# EAGLE design JediLightSwitch (EAGLE 7.4.0)

## Sheet 1 of 2
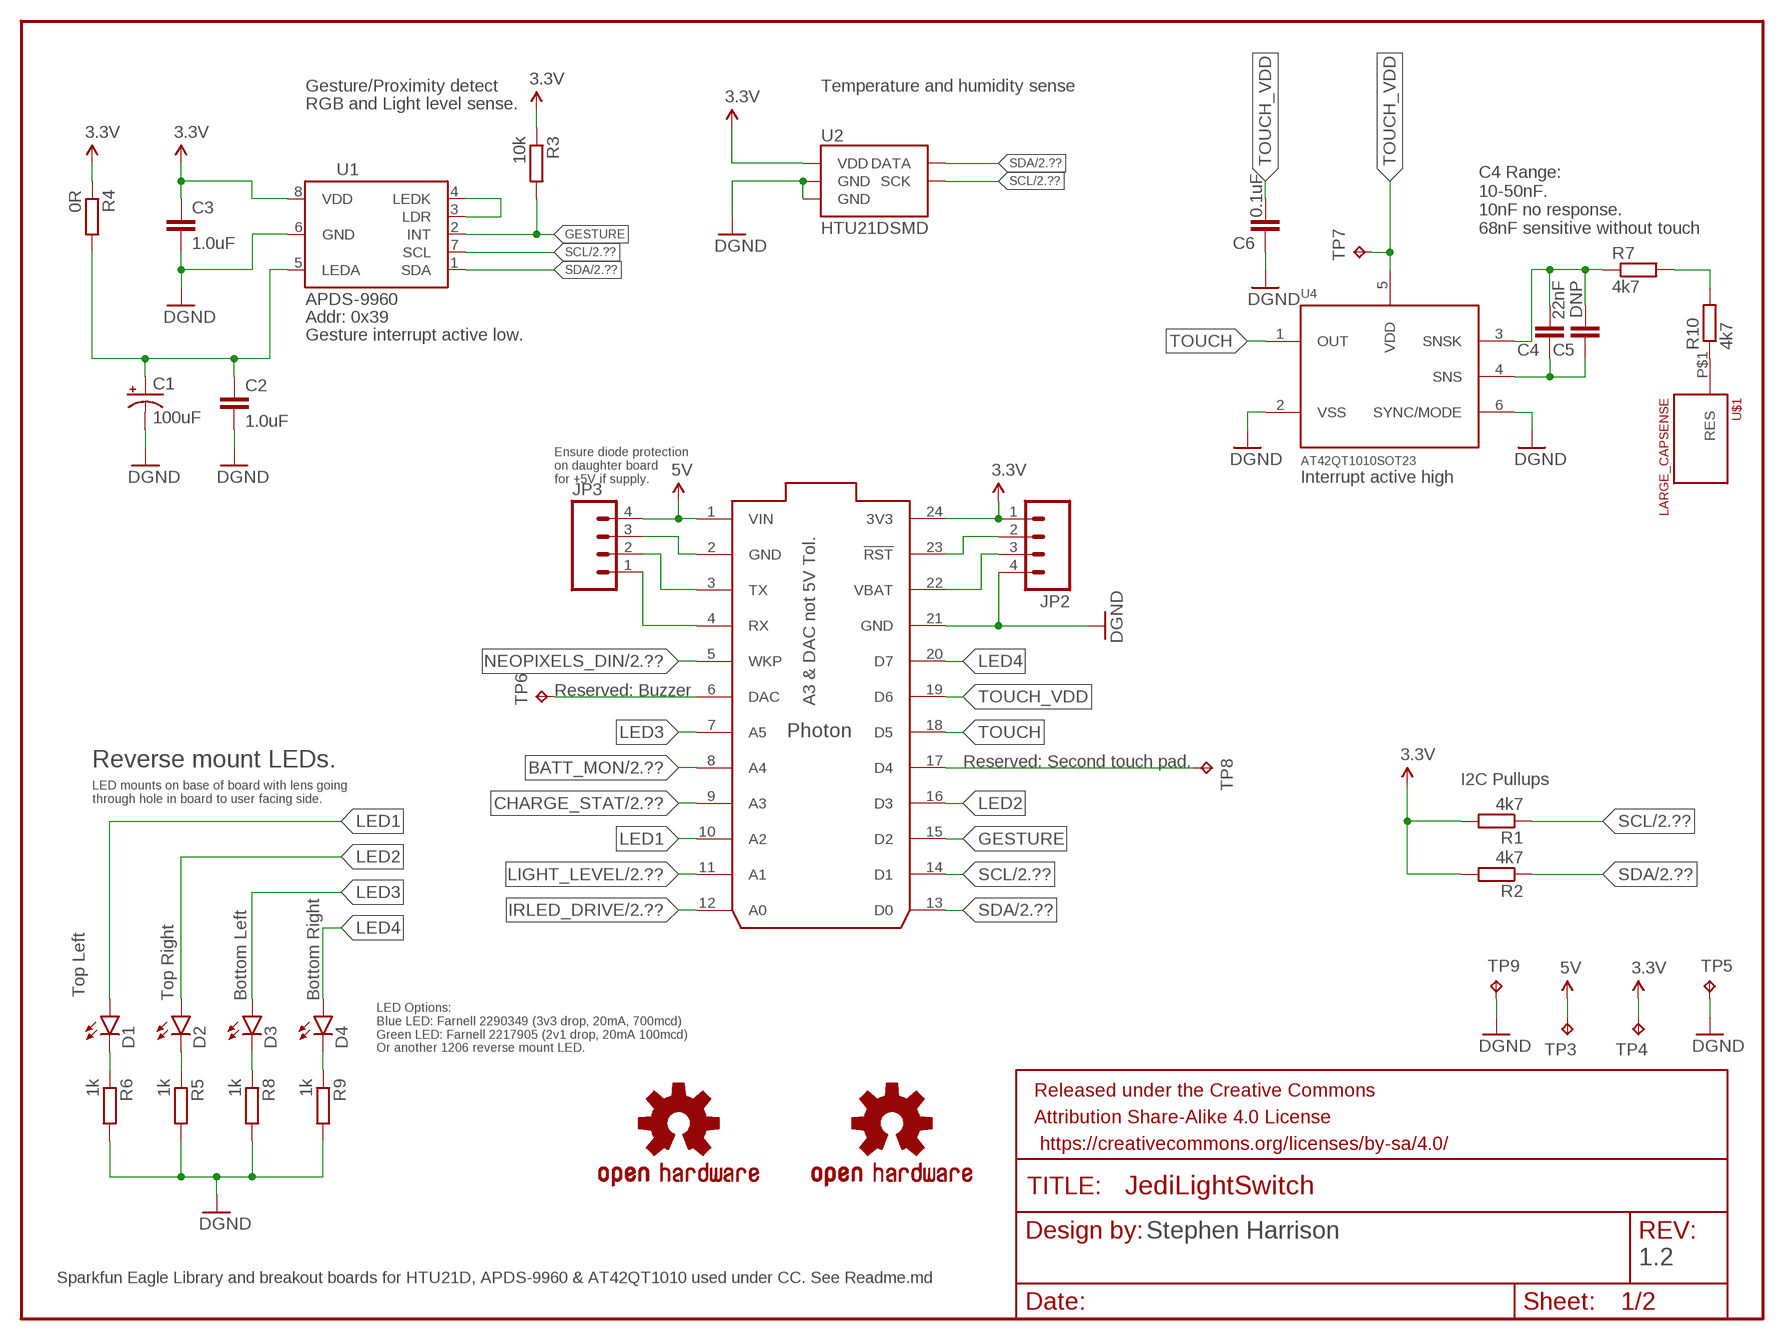
[diagram p0: schematic, sheet 1]

### Parts
C1  100uF  100UF-10V-10%(TANT)  [EIA7343]
C2  1.0uF  C-EUC0805  [C0805]
C3  1.0uF  C-EUC0805  [C0805]
C4  22nF  C-EUC0805  [C0805]
C5  DNP  C-EUC0805  [C0805]
C6  0.1uF  C-EUC0805  [C0805]
D1  LED1206-BOTTOM  [LED-1206-BOTTOM]
D2  LED1206-BOTTOM  [LED-1206-BOTTOM]
D3  LED1206-BOTTOM  [LED-1206-BOTTOM]
D4  LED1206-BOTTOM  [LED-1206-BOTTOM]
FRAME2  FRAME-LETTER  [CREATIVE_COMMONS]
JP2  M04SMD_STRAIGHT_COMBO  [1X04_SMD_STRAIGHT_COMBO]
JP3  M04SMD_STRAIGHT_COMBO  [1X04_SMD_STRAIGHT_COMBO]
LOGO1  OSHW-LOGOM  [OSHW-LOGO-M]
LOGO2  OSHW-LOGOM  [OSHW-LOGO-M]
R1  4k7  R-EU_R0805  [R0805]
R2  4k7  R-EU_R0805  [R0805]
R3  10k  R-EU_R0805  [R0805]
R4  0R  R-EU_R0805  [R0805]
R5  1k  R-EU_R0805  [R0805]
R6  1k  R-EU_R0805  [R0805]
R7  4k7  R-EU_R0805  [R0805]
R8  1k  R-EU_R0805  [R0805]
R9  1k  R-EU_R0805  [R0805]
R10  4k7  R-EU_R0805  [R0805]
TP3  TPTP20R  [TP20R]
TP4  3v3  TPTP20R  [TP20R]
TP5  TPTP20R  [TP20R]
TP6  TPTP20R  [TP20R]
TP7  TPTP20R  [TP20R]
TP8  TPTP20R  [TP20R]
TP9  TPTP20R  [TP20R]
U1  APDS-9960  [APDS-9960]
U2  HTU21DSMD  [HTU21D]
U3  PHOTON_SMD  [PHOTON_SMD]
U4  AT42QT1010SOT23  [SOT23-6]
U$1  LARGE_CAPSENSE  [LARGE_CAPSENSE]

### Nets
3.3V: C3.1 JP2.1 R1.2 R2.2 R3.1 R4.1 TP4.TP U1.8(VDD) U2.VDD U3.24(3V3) ; also sheet 2
5V: JP3.4 TP3.TP U3.1(VIN) ; also sheet 2
BATT_MON: U3.8(A4) ; also sheet 2
CHARGE_STAT: U3.9(A3) ; also sheet 2
D4: TP8.TP U3.17(D4)
DAC: TP6.TP U3.6(DAC)
GESTURE: R3.2 U1.2(INT) U3.15(D2)
GND: C1.C(-) C2.2 C3.2 C6.1 JP2.4 JP3.3 R5.2 R6.2 R8.2 R9.2 TP5.TP TP9.TP U1.6(GND) U2.7(GND) U2.GND U3.2(GND) U3.21(GND) U4.2(VSS) U4.6(SYNC/MODE) ; supply symbol labelled DGND ; also sheet 2
IRLED_DRIVE: U3.12(A0) ; also sheet 2
LED1: D1.A U3.10(A2)
LED2: D2.A U3.16(D3)
LED3: D3.A U3.7(A5)
LED4: D4.A U3.20(D7)
LIGHT_LEVEL: U3.11(A1) ; also sheet 2
N$1: U1.3(LDR) U1.4(LEDK)
N$2: C1.A(+) C2.1 R4.2 U1.5(LEDA)
N$3: D2.C R5.1
N$4: D1.C R6.1
N$5: JP2.2 U3.23(!RST)
N$7: JP2.3 U3.22(VBAT)
N$8: R7.2 R10.2
N$9: R10.1 U$1.P$1(RES)
N$14: JP3.1 U3.4(RX)
N$15: JP3.2 U3.3(TX)
N$19: C4.2 C5.2 R7.1 U4.3(SNSK)
N$20: C4.1 C5.1 U4.4(SNS)
N$30: D3.C R8.1
N$31: D4.C R9.1
NEOPIXELS_DIN: U3.5(WKP) ; also sheet 2
SCL: R1.1 U1.7(SCL) U2.SCK U3.14(D1) ; also sheet 2
SDA: R2.1 U1.1(SDA) U2.DATA U3.13(D0) ; also sheet 2
TOUCH: U3.18(D5) U4.1(OUT)
TOUCH_VDD: C6.2 TP7.TP U3.19(D6) U4.5(VDD)
Unconnected: U3.25(EN) U3.26(!SETUP) U3.27(RGB_RED) U3.28(RGB_GREEN) U3.29(RGB_BLUE) U3.30(USB_D-) U3.31(USB_D+)

### Notes on the sheet
- Gesture/Proximity detect | Temperature and humidity sense
- RGB and Light level sense.
- C4 Range: 
  10-50nF. 
  10nF no response.
  68nF sensitive without touch
- Addr: 0x39
- Gesture interrupt active low.
- Ensure diode protection 
  on daughter board 
  for +5V if supply.
- Interrupt active high
- A3 & DAC not 5V Tol.
- Reserved: Buzzer
- Reverse mount LEDs. | Reserved: Second touch pad.
- I2C Pullups
- LED mounts on base of board with lens going 
  through hole in board to user facing side.
- Top Left | Top Right | Bottom Left | Bottom Right
- LED Options:
  Blue LED: Farnell 2290349 (3v3 drop, 20mA, 700mcd)
  Green LED: Farnell 2217905 (2v1 drop, 20mA 100mcd)
  Or another 1206 reverse mount LED.
- Stephen Harrison
- 1.2
- Sparkfun Eagle Library and breakout boards for HTU21D, APDS-9960 & AT42QT1010 used under CC. See Readme.md

## Sheet 2 of 2
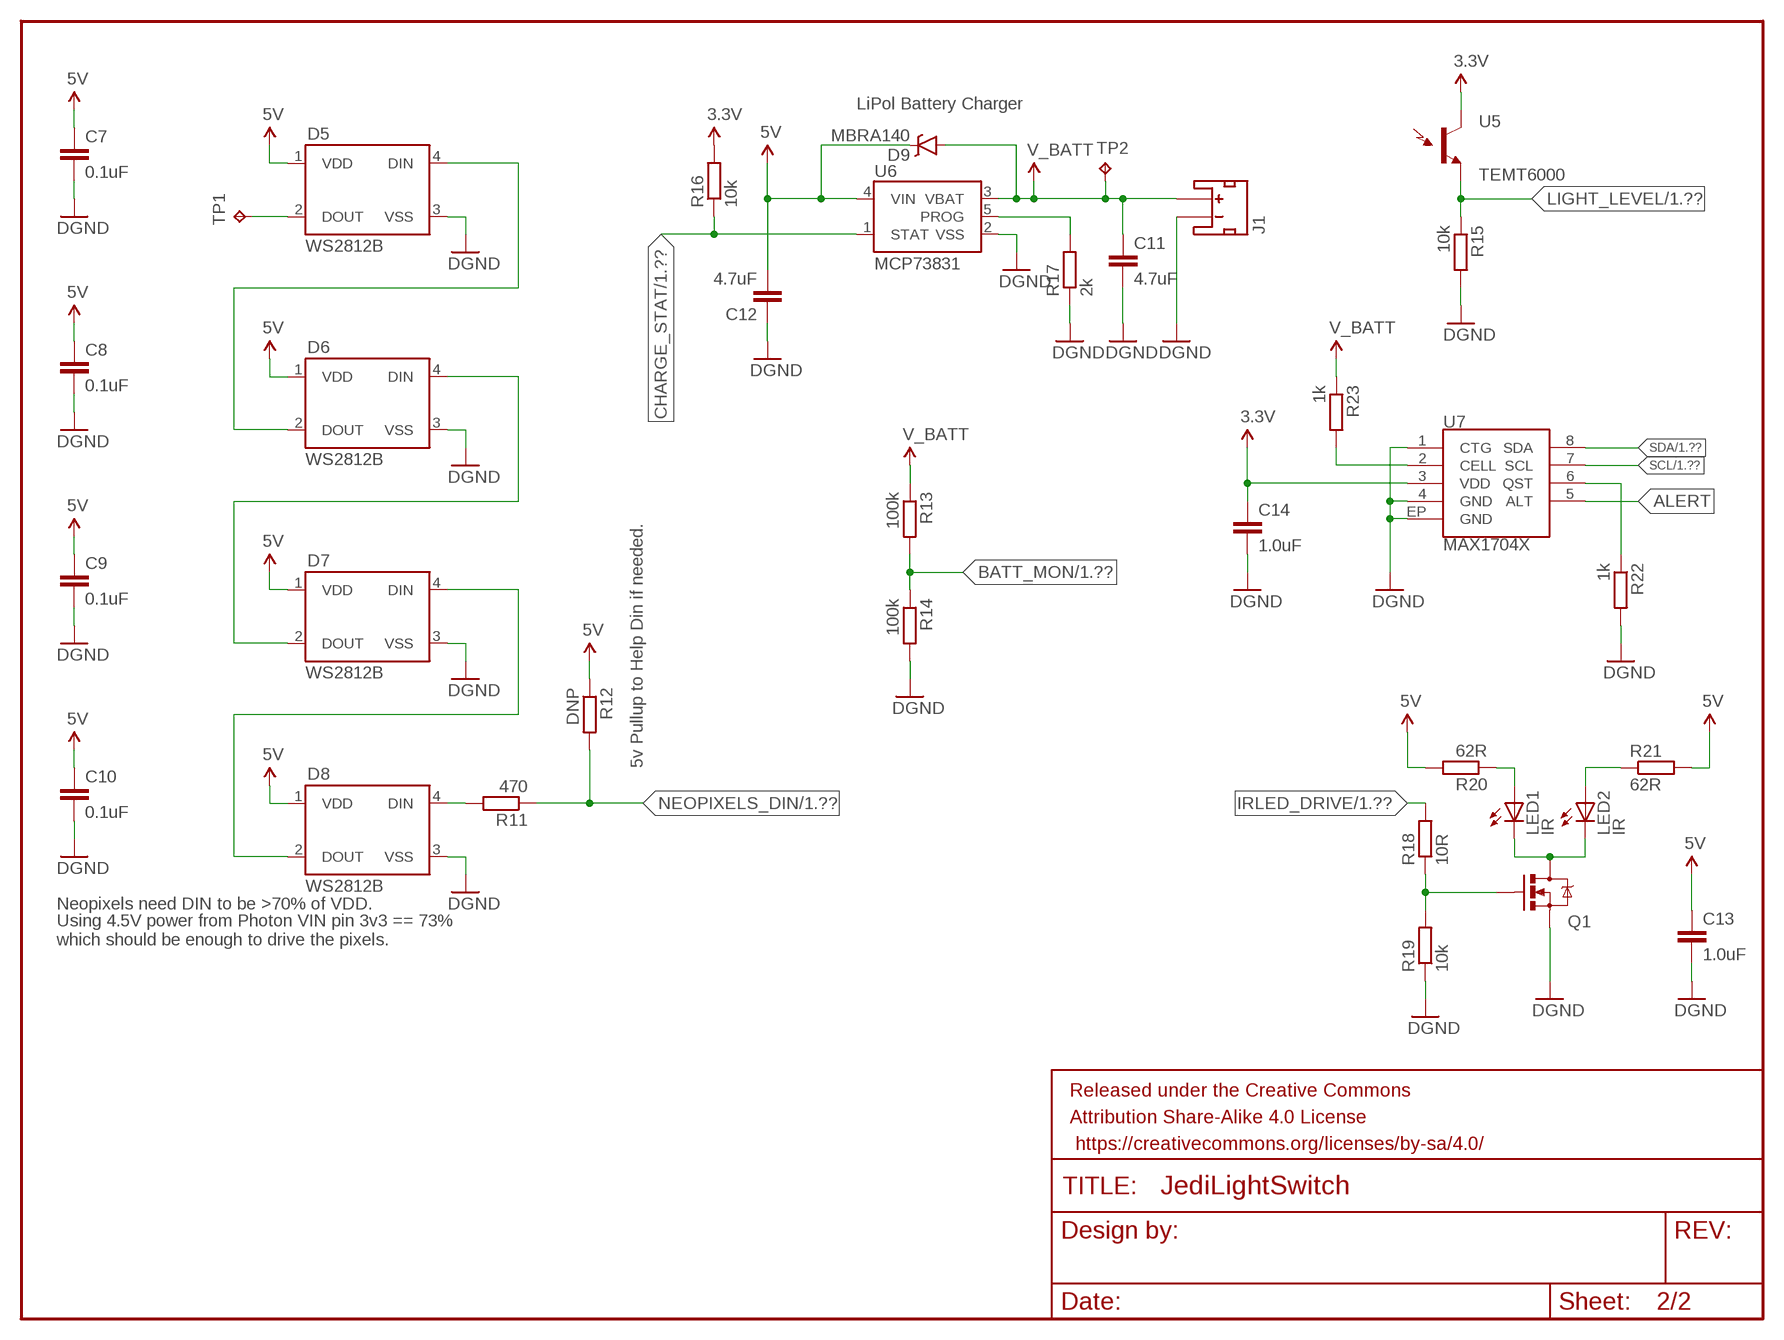
[diagram p1: schematic, sheet 2]

### Parts
C7  0.1uF  C-EUC0805  [C0805]
C8  0.1uF  C-EUC0805  [C0805]
C9  0.1uF  C-EUC0805  [C0805]
C10  0.1uF  C-EUC0805  [C0805]
C11  4.7uF  C-EUC0805  [C0805]
C12  4.7uF  C-EUC0805  [C0805]
C13  1.0uF  C-EUC0805  [C0805]
C14  1.0uF  C-EUC0805  [C0805]
D5  WS2812B  [WS2812B]
D6  WS2812B  [WS2812B]
D7  WS2812B  [WS2812B]
D8  WS2812B  [WS2812B]
D9  MBRA140  [SMA-DIODE]
FRAME1  FRAME-LETTERNO_PACKAGE  [DUMMY]
J1  JST_2MM_MALE  [JST-2-SMD]
LED1  IR  LEDSMT1206  [1206]
LED2  IR  LEDSMT1206  [1206]
Q1  MOSFET-NCHANNELAO3404A  [SOT23-3]
R11  470  R-EU_R0805  [R0805]
R12  DNP  R-EU_R0805  [R0805]
R13  100k  R-EU_R0805  [R0805]
R14  100k  R-EU_R0805  [R0805]
R15  10k  R-EU_R0805  [R0805]
R16  10k  R-EU_R0805  [R0805]
R17  2k  R-EU_R0805  [R0805]
R18  10R  R-EU_R0805  [R0805]
R19  10k  R-EU_R0805  [R0805]
R20  62R  R-EU_R0805  [R0805]
R21  62R  R-EU_R0805  [R0805]
R22  1k  R-EU_R0805  [R0805]
R23  1k  R-EU_R0805  [R0805]
TP1  TPTP20R  [TP20R]
TP2  TPTP20R  [TP20R]
U5  TEMT6000  LIGHTSENSORTEMT6000  [TEMT6000-SEN]
U6  MCP73831  [SOT23-5]
U7  MAX1704X  [TDFN-8]

### Nets
3.3V: C14.1 R16.2 U5.COLLECTOR(C1) U7.3(VDD) ; also sheet 1
5V: C7.1 C8.1 C9.1 C10.1 C12.2 C13.1 D5.1(VDD) D6.1(VDD) D7.1(VDD) D8.1(VDD) D9.C R12.1 R20.2 R21.2 U6.4(VIN) ; also sheet 1
ALERT: U7.5(ALT)
BATT_MON: R13.2 R14.1 ; also sheet 1
CHARGE_STAT: R16.1 U6.1(STAT) ; also sheet 1
GND: C7.2 C8.2 C9.2 C10.2 C11.2 C12.1 C13.2 C14.2 D5.3(VSS) D6.3(VSS) D7.3(VSS) D8.3(VSS) J1.1(-) Q1.2(S) R14.2 R15.2 R17.1 R19.1 R22.2 U6.2(VSS) U7.1(CTG) U7.4(GND) U7.EP(GND) ; supply symbol labelled DGND ; also sheet 1
IRLED_DRIVE: R18.2 ; also sheet 1
LIGHT_LEVEL: R15.1 U5.EMITTER(E1) ; also sheet 1
N$6: Q1.1(G) R18.1 R19.2
N$11: R17.2 U6.5(PROG)
N$12: LED1.A R20.1
N$13: D7.4(DIN) D8.2(DOUT)
N$16: R23.2 U7.2(CELL)
N$17: D5.2(DOUT) TP1.TP
N$18: D6.4(DIN) D7.2(DOUT)
N$21: D5.4(DIN) D6.2(DOUT)
N$22: D8.4(DIN) R11.2
N$23: LED2.A R21.1
N$24: LED1.C LED2.C Q1.3(D)
N$25: R22.1 U7.6(QST)
NEOPIXELS_DIN: R11.1 R12.2 ; also sheet 1
SCL: U7.7(SCL) ; also sheet 1
SDA: U7.8(SDA) ; also sheet 1
V_BATT: C11.1 D9.A J1.2(+) R13.1 R23.1 TP2.TP U6.3(VBAT)
Unconnected: J1.NC1(PAD1) J1.NC2(PAD2)

### Notes on the sheet
- LiPol Battery Charger
- 5v Pullup to Help Din if needed.
- Neopixels need DIN to be >70% of VDD.
- Using 4.5V power from Photon VIN pin 3v3 == 73% 
  which should be enough to drive the pixels.

## Library data of the parts
C1 = SparkFun-Capacitors:100UF-10V-10%(TANT): CAP-07890; PROD_ID: CAP-07890
C2-C14 = rcl:C-EU: CAPACITOR, European symbol
D1-D4 = SparkFun-LED:LED: LEDs Standard schematic elements and footprints for 5mm, 3mm, 1206, and 0603 sized LEDs. 5mm - Spark Fun Electronics SKU : COM-00529 (and others)
D5-D8 = SparkFun-LED:WS2812B: WS2812B - Intelligent control LED integrated light source Technical Specifications: Power Supply Voltage (VDD): 3.5 to 5.3 V Input Voltage (VI): -0.5 to VDD+0.5 V Operating Junction Temperature (Topt): -25°C to +80°C Storage Temperature Range (Tstg): -55°C to +150°C; PROD_ID: DIO-12503
D9 = SparkFun-DiscreteSemi:MBRA140: 40V, 1A Schottky rectifier SMA/DO-214AC package DIO-08053; PROD_ID: DIO-08053
FRAME1 = SparkFun-Aesthetics:FRAME-LETTER: Schematic Frame Standard 8.5x11 US Letter frame; DESIGNER: Nobody; VERSION: v01
FRAME2 = SparkFun-Aesthetics:FRAME-LETTER: Schematic Frame Standard 8.5x11 US Letter frame
J1 = SparkFun-Connectors:JST_2MM_MALE: Mates to single-cell LiPo batteries. CONN-11443 Now with smashable polarity marks!; BTM_NEG: -; BTM_POS: +; PROD_ID: CONN-11443; TOP_NEG: -; TOP_POS: +
JP2 JP3 = SparkFun-Connectors:M04: Header 4 Standard 4-pin 0.1" header. Use with straight break away headers (SKU : PRT-00116), right angle break away headers (PRT-00553), swiss pins (PRT-00743), machine pins (PRT-00117), and female headers (PRT-00115). Molex polarized connector foot print use with SKU : PRT-08231 with associated crimp pins and housings. 1MM SMD Version SKU: PRT-10208; PROD_ID: CONN-08511; VALUE: 1X04_SMD_STRAIGHT_COMBO
LED1 LED2 = led:LED: LED OSRAM: - CHIPLED LG R971, LG N971, LY N971, LG Q971, LY Q971, LO R971, LY R971 LH N974, LH R974 LS Q976, LO Q976, LY Q976 LO Q996 - Hyper CHIPLED LW Q18S LB Q993, LB Q99A, LB R99A - SideLED LS A670, LO A670, LY A670, LG A670, LP A670 LB A673, LV A673, LT A673, LW A673 LH A674 LY A675 LS A676, LA A676, LO A676, LY A676, LW A676 LS A679, LY A679, LG A679 - Hyper Micro SIDELED® LS Y876, LA Y876, LO Y876, LY Y876 LT Y87S - SmartLED LW L88C, LW L88S LB L89C, LB L89S, LG L890 LS L89K, LO L89K, LY L89K LS L896, LA L896, LO L896, LY L896 - TOPLED LS T670, LO T670, LY T670, LG T670, LP T670 LSG T670, LSP T670, LSY T670, LOP T670, LYG T670 LG T671, LOG T671, LSG T671 LB T673, LV T673, LT T673, LW T673 LH T674 LS T676, LA T676, LO T676, LY T676, LB T676, LH T676, LSB T676, LW T676 LB T67C, LV T67C, LT T67C, LS T67K, LO T67K, LY T67K, LW E67C LS E67B, LA E67B, LO E67B, LY E67B, LB E67C, LV E67C, LT E67C LW T67C LS T679, LY T679, LG T679 LS T770, LO T770, LY T770, LG T770, LP T770 LB T773, LV T773, LT T773, LW T773 LH T774 LS E675, LA E675, LY E675, LS T675 LS T776, LA T776, LO T776, LY T776, LB T776 LHGB T686 LT T68C, LB T68C - Hyper Mini TOPLED® LB M676 - Mini TOPLED Santana® LG M470 LS M47K, LO M47K, LY M47K Source: http://www.osram.convergy.de LUXEON: - LUMILED® LXK2-PW12-R00, LXK2-PW12-S00, LXK2-PW14-U00, LXK2-PW14-V00 LXK2-PM12-R00, LXK2-PM12-S00, LXK2-PM14-U00 LXK2-PE12-Q00, LXK2-PE12-R00, LXK2-PE12-S00, LXK2-PE14-T00, LXK2-PE14-U00 LXK2-PB12-K00, LXK2-PB12-L00, LXK2-PB12-M00, LXK2-PB14-N00, LXK2-PB14-P00, LXK2-PB14-Q00 LXK2-PR12-L00, LXK2-PR12-M00, LXK2-PR14-Q00, LXK2-PR14-R00 LXK2-PD12-Q00, LXK2-PD12-R00, LXK2-PD12-S00 LXK2-PH12-R00, LXK2-PH12-S00 LXK2-PL12-P00, LXK2-PL12-Q00, LXK2-PL12-R00 Source: www.luxeon.com KINGBRIGHT: KA-3528ASYC Source: www.kingbright.com
LOGO1 LOGO2 = SparkFun-Aesthetics:OSHW-LOGO: Open Source Hardware Logo This logo indicates the piece of hardware it is found on incorporates a OSHW license and/or adheres to the definition of open source hardware found here: http://freedomdefined.org/OSHW
Q1 = SparkFun-DiscreteSemi:MOSFET-NCHANNEL: Common NMOSFET Parts MFG P/N Store ID Prod ID FDD8780 TRANS-09984 SI7820DN TRANS-11055 FDS6630A IC-08089 2N7002PW TRANS-11151 FQP30N06L COM-10213 TRANS-10060 BSS123LT1G TRANS-08345 BSS138 TRANS-00830 BS170 2N7000; PROD_ID: TRAN-12988
R1-R23 = rcl:R-EU_: RESISTOR, European symbol
TP1-TP9 = testpad:TP: Test pad
U1 = SparkFun-Sensors:APDS-9960: Avago APDS-9960 digital proximity, ambient light, RGB, and gesture sensor.; PROD_ID: SEN-12005
U2 = SparkFun-Sensors:HTU21D; PROD_ID: IC-11793
U3 = Particle:PHOTON_SMD: Photon (without headers) - designed to be surface mounted with 7 extra exposed pads on the bottom of the board which include, 3 RGB LED outputs, /SETUP, EN (3.3V SMPS enable input), USB D+ and USB D-.
U4 = SparkFun-DigitalIC:AT42QT1010
U5 = SparkFun-Sensors:LIGHTSENSOR: Ambient Light Sensor Simple light detection sensor. Output varies with light intensity input. Spark Fun Electronics SKU : COM-08348
U6 = SparkFun-PowerIC:MCP73831: Miniature single cell, fully integrated Li-Ion, Li-polymer charge management controller http://ww1.microchip.com/downloads/en/DeviceDoc/20001984g.pdf IC-09995; PROD_ID: IC-09995
U7 = SparkFun-PowerIC:MAX1704X: MAX17043/MAX17044: Battery Fuel Guage (43 is 1cell, 44 is 2cell); PROD-ID: IC-10399
U$1 = Tinamous:LARGE_CAPSENSE

## Board
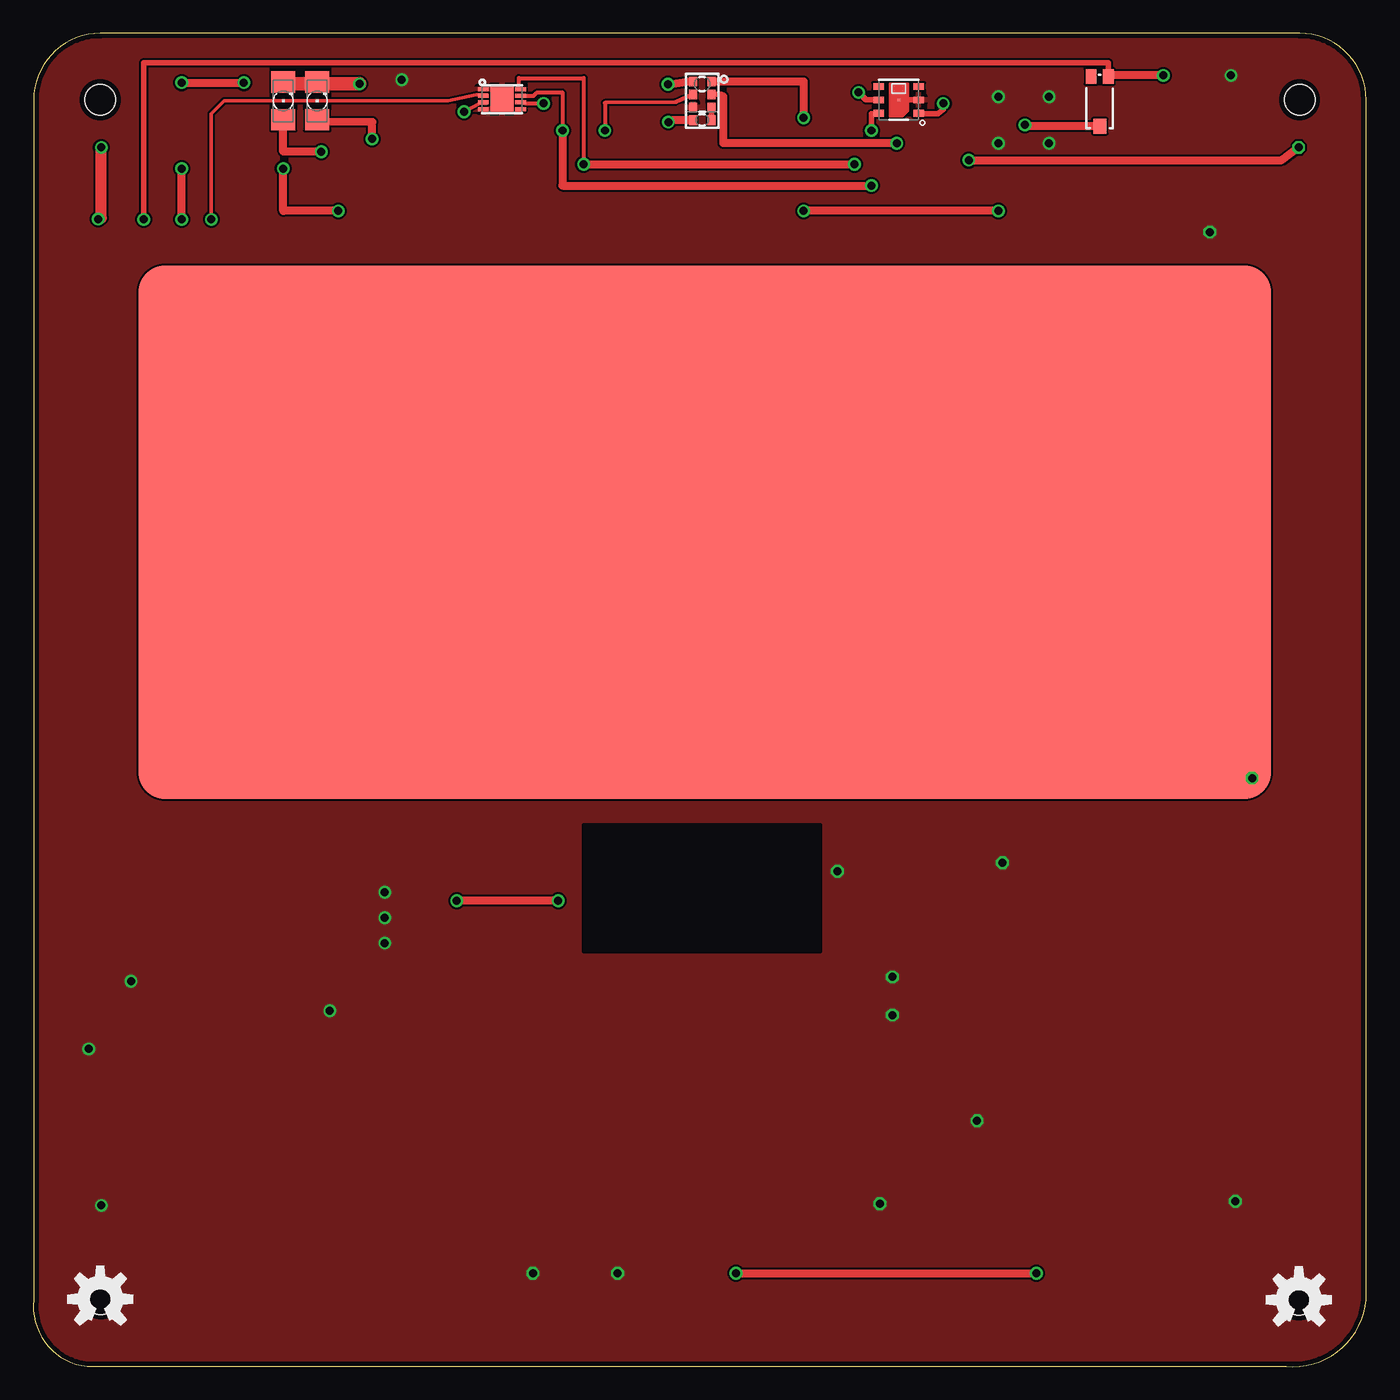
[diagram p2: board, top side]
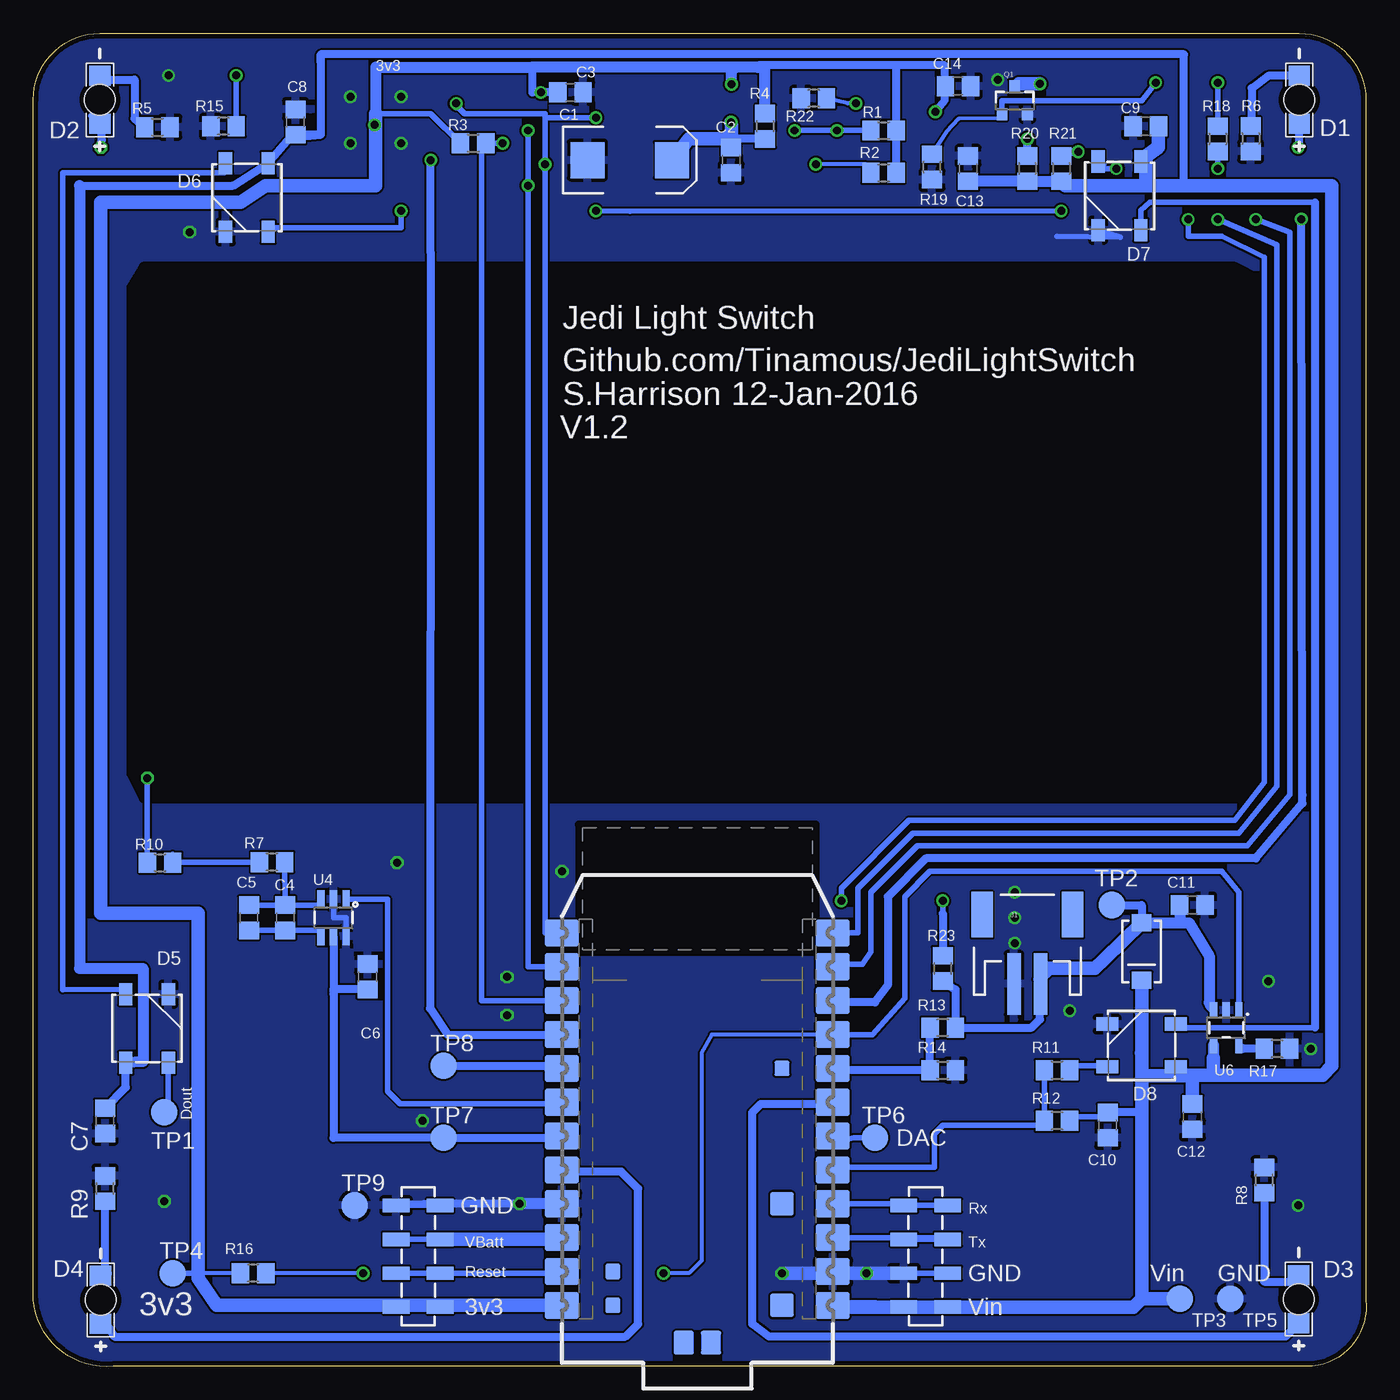
[diagram p3: board, bottom side, seen from below]

Size 100.03 x 100.02 mm. Coordinates in mm from the lower left corner, seen from the top.
Outline: 4.03,0.02 94.03,0.02 arc90 100.03,5.02 100.03,95.02 arc90 95.03,100.02 5.03,100.02 arc90 0.03,95.02 0.03,5.02 arc90 4.03,0.02
Copper layers (1*16): Top 0.0356mm / dielectric 1.5011mm / Bottom 0.0356mm
Design rules "OSHPark *": minimum track width 6mil, minimum drill 13mil, track to track 6mil, track to pad 6mil, pad to pad 6mil, via to via 6mil, smd to smd 6mil, copper to edge 15mil, drill to drill 6mil, minimum pad ring 7mil, minimum via ring 7mil, stop-mask expansion 3mil, vias tented up to drill 25mil, thermal gap 10mil
tRestrict: area 41.3,31.1 to 59.1,40.7
bRestrict: area 41.3,31.1 to 59.1,40.7; area 8,42.6 to 92.7,82.6

### Footprints (pad centres in the part's own frame; a part is rotated, then mirrored left to right if it is on the bottom)
EIA7343 = smd 2.55 x 2.7: A 3.17,0; C -3.17,0
C0805 = smd 1.3 x 1.5: 1 -0.95,0; 2 0.95,0
LED-1206-BOTTOM = smd 1.5 x 1.6: A -1.8,0; C 1.8,0 | hole 2.3: 0,0
WS2812B = smd 1.651 x 1: 1 -2.577,1.6; 2 -2.577,-1.6; 3 2.577,-1.6; 4 2.577,1.6
SMA-DIODE = smd 1.27 x 1.47: A -2.15,0; C 2.15,0
JST-2-SMD = smd 1 x 4.6: 1 -1,-3.7; 2 1,-3.7 | smd 1.6 x 3.4: NC1 -3.4,1.5; NC2 3.4,1.5
1X04_SMD_STRAIGHT_COMBO = smd 1 x 2: 1 0,-1.65; 1-2 0,1.65; 2 2.54,1.65; 2-2 2.54,-1.65; 3 5.08,-1.65; 3-2 5.08,1.65; 4 7.62,1.65; 4-2 7.62,-1.65
1206 = smd 1.6 x 1.803: A -1.422,0; C 1.422,0
SOT23-3 = smd 0.8 x 0.9: 1 -0.95,-1; 2 0.95,-1; 3 0,1.1
R0805 = smd 1.3 x 1.5: 1 -0.95,0; 2 0.95,0
TP20R = smd 2 x 2: TP 0,0
APDS-9960 = smd 0.6 x 0.72: 1 0.7,1.455; 2 0.7,0.485; 3 0.7,-0.485; 4 0.7,-1.455; 5 -0.7,-1.455; 6 -0.7,-0.485; 7 -0.7,0.485; 8 -0.7,1.455
HTU21D = smd 0.2 x 0.2: 7 0,0 | smd 0.8 x 0.5: DATA 1.5,-1; GND 1.5,0; NC@1 -1.5,1; NC@6 1.5,1; SCK -1.5,-1; VDD -1.5,0
PHOTON_SMD = smd 2.54 x 2.032: 1 0,32.258; 2 0,29.718; 3 0,27.178; 4 0,24.638; 5 0,22.098; 6 0,19.558; 7 0,17.018; 8 0,14.478; 9 0,11.938; 10 0,9.398; 11 0,6.858; 12 0,4.318; 13 20.32,4.318; 14 20.32,6.858; 15 20.32,9.398; 16 20.32,11.938; 17 20.32,14.478; 18 20.32,17.018; 19 20.32,19.558; 20 20.32,22.098; 21 20.32,24.638; 22 20.32,27.178; 23 20.32,29.718; 24 20.32,32.258 | smd 1.778 x 1.778: 25 3.81,32.258; 26 3.81,24.638 | smd 1.143 x 1.143: 27 3.81,14.478; 28 16.51,29.718; 29 16.51,32.258 | smd 1.524 x 1.778: 30 11.176,35.052; 31 9.144,35.052
SOT23-6 = smd 0.55 x 1.35: 1 -0.95,-1.375; 2 0,-1.375; 3 0.95,-1.375; 4 0.95,1.375; 5 0,1.375; 6 -0.95,1.375
TEMT6000-SEN = smd 1.1 x 0.8: BASE -1.87,-0.65; EMITTER -1.87,0.65 | smd 1.1 x 1: COLLECTOR 1.86,0.01
SOT23-5 = smd 0.55 x 1.2: 1 -0.95,-1.3; 2 0,-1.3; 3 0.95,-1.3; 4 0.95,1.3; 5 -0.95,1.3
TDFN-8 = smd 0.8 x 0.3: 1 -1.4,0.75; 2 -1.4,0.25; 3 -1.4,-0.25; 4 -1.4,-0.75; 5 1.4,-0.75; 6 1.4,-0.25; 7 1.4,0.25; 8 1.4,0.75 | smd 1.73 x 1.88: EP 0,0
LARGE_CAPSENSE = smd 85 x 40: P$1 12.865,17.495

### Placement (x,y rotation side)
C1  55.27,90.51 0 bottom
C2  47.65,90.51 270 bottom
C3  59.72,95.59 0 bottom
C4  81.12,33.68 90 bottom
C5  83.85,33.68 90 bottom
C6  74.94,29.25 270 bottom
C7  94.64,18.44 270 bottom
C8  80.35,93.37 90 bottom
C9  16.54,93.05 180 bottom
C10  19.39,18.12 270 bottom
C11  13.04,34.63 0 bottom
C12  13.04,18.76 90 bottom
C13  29.87,89.88 90 bottom
C14  30.63,96.06 0 bottom
D1  5.03,95.03 90 bottom
D2  95.03,95.03 90 bottom
D3  5.07,5.07 90 bottom
D4  94.98,5 90 bottom
D5  91.49,25.37 90 bottom
D6  84,87.7 270 bottom
D7  18.52,87.83 270 bottom
D8  16.86,24.1 180 bottom
D9  16.85,31.14 270 bottom
FRAME1  -27.91,-35.85 0 top  (outside the outline)
FRAME2  19.8,-34.72 0 top  (outside the outline)
J1  25.43,32.41 0 bottom
JP2  71.15,4.47 90 bottom
JP3  33.05,12.09 270 bottom
LED1  21.3,94.96 90 top
LED2  18.76,94.96 90 top
LOGO1  94.98,5 0 top
LOGO2  5.03,5.06 0 top
Q1  26.38,94.96 0 bottom
R1  36.22,92.73 0 bottom
R2  36.22,89.56 0 bottom
R3  67.02,91.78 0 bottom
R4  45.11,93.05 270 bottom
R5  90.72,92.99 0 bottom
R6  8.66,92.12 270 bottom
R7  82.11,37.85 180 bottom
R8  7.65,13.99 90 bottom
R9  94.64,13.36 90 bottom
R10  90.51,37.81 0 bottom
R11  23.2,22.25 0 bottom
R12  23.2,18.44 180 bottom
R13  31.78,25.42 180 bottom
R14  31.78,22.25 0 bottom
R15  85.75,93.05 180 bottom
R16  83.53,7.01 180 bottom
R17  6.69,23.84 180 bottom
R18  11.14,92.1 270 bottom
R19  32.58,90 90 bottom
R20  25.43,89.88 270 bottom
R21  22.89,89.88 270 bottom
R22  41.45,95.15 180 bottom
R23  31.78,29.87 90 bottom
TP1  90.2,19.07 0 bottom
TP2  19.08,34.63 0 bottom
TP3  14,5.1 0 bottom
TP4  89.56,7.01 0 bottom
TP5  10.19,5.1 0 bottom
TP6  36.86,17.17 0 bottom
TP7  69.24,17.17 0 bottom
TP8  69.24,22.57 0 bottom
TP9  75.91,12.09 0 bottom
U1  50.19,94.96 0 top
U2  64.94,95.03 0 top
U3  40.03,36.85 180 bottom
U4  77.5,33.68 180 bottom
U5  80.03,94.91 270 top
U6  10.5,25.42 180 bottom
U7  35.17,95.1 0 top
U$1  37.53,45.11 0 top

### Tracks (layer width: path | path; a pad name or v marks a point on that pad's centre or on a via)
3.3V  (via drill 0.6)
  Top 0.254: U7.3 34.01,94.77 33.54,94.77 33.53,94.76 v32.33,94.14
  Top 0.305: 49.49,96.47 U1.8
  Top 0.406: 74.32,93.05 v74.42,93.15 | U2.VDD 62.5,95.03 v61.94,95.59
  Top 0.61: U5.COLLECTOR 74.32,93.05 | v47.63,96.2 47.97,96.23 49.49,96.47
  Bottom 0.254: 45.11,96.22 R4.1
  Bottom 0.305: 67.02,4.47 66.83,4.47 66.7,4.59 | R16.2 87.66,7.01
  Bottom 0.406: 60.86,4.47 U3.24 60.35,4.47 67.02,4.47 JP2.1 | TP4.TP 87.66,7.01 | v74.42,93.15 74.42,94.42 74.32,97.49 | R3.1 70.19,94 74.32,94
  Bottom 0.61: v32.33,94.14 31.62,95.02 C14.1 31.62,97.62 35.27,97.62 | 35.27,97.62 45.62,97.62 45.75,97.49 | C3.1 v61.94,95.59 62.57,95.59 62.57,97.49 | R2.2 R1.2 35.27,97.62
  Bottom 0.813: R4.1 45.11,97.49 45.75,97.49 47.33,97.49 | 74.32,94 74.32,97.49 62.57,97.49 47.33,97.49 | v47.63,96.2 47.63,97.2 47.33,97.49
  Bottom 1.016: U3.24 66.7,4.59 86.26,4.59 87.66,6.63 87.66,7.01 87.66,33.99 94.96,34 94.96,45.43 94.96,53.68 94.96,82.26 94.96,87.33 84.48,87.33 82.58,88.6 74.32,88.6 74.32,94
5V
  Bottom 0.406: 31.59,4.59 JP3.4 31.78,4.47 31.78,4.59 | 22.25,18.76 20.98,18.76 19.71,18.76 C10.1 | 17.17,23.52 16.85,24.47
  Bottom 0.61: 13.68,88.6 13.68,98.45 78.45,98.45 | C7.1 93.09,20.94 D5.1 | 16.85,20.98 16.86,19.07 C10.1 | 22.25,18.76 R12.1 | 78.45,97.81 78.45,98.45 | 78.45,98.45 78.45,92.41 | 78.45,92.41 C8.1 | 96.55,88.6 85.03,88.6 D6.1 80.76,92.18 78.45,92.41
  Bottom 0.813: U3.1 36.86,4.59 | D5.1 91.78,22.88 91.78,29.87 96.55,29.87 96.55,88.6 | U6.4 11.45,23.13 | 13.68,21.83 D8.1 14.35,22.57 | R21.2 R20.2 C13.1
  Bottom 1.016: U3.1 39.4,4.47 JP3.4 17.49,4.47 16.85,5.1 | D8.1 14,21.86 13.29,21.86 | 13.29,21.86 11.46,21.86 | 11.46,21.86 3.27,21.86 2.57,22.57 2.57,88.6 13.68,88.6 16.54,88.6 | 11.45,23.13 11.46,21.86 | D9.C 16.85,24.47 16.85,21.61 | 16.85,21.61 16.85,20.98 16.85,5.1 | 13.68,21.83 16.64,21.83 16.85,21.61 | C12.2 13.04,21.61 13.29,21.86 | TP3.TP 16.85,5.1 | 16.54,88.6 22.57,88.6 R21.2 | C9.1 15.58,91.46 16.54,90.79 | 16.54,90.79 D7.1 | 16.54,90.79 16.54,88.6
BATT_MON
  Bottom 0.61: R13.2 R14.1 39.9,22.25 U3.8
CHARGE_STAT  (via drill 0.6)
  Top 0.61: v52.73,7.01 v75.27,7.01
  Bottom 0.305: U3.9 49.11,24.91 49.87,23.52 49.87,7.96 50.83,7.01 v52.73,7.01 | v75.27,7.01 R16.1
  Bottom 0.406: U6.1 9.55,35.58 10.82,37.17 32.73,37.17 34.63,35.26 34.63,27.64 37.05,24.91 U3.9
D4
  Bottom 0.61: TP8.TP 61.62,22.57 61.3,22.25 60.48,22.25 U3.17
DAC
  Bottom 0.406: TP6.TP 38.44,17.17 40.03,16.85 U3.6
GESTURE  (via drill 0.6)
  Top 0.406: 51.78,95.27 51.61,95.44 U1.2
  Top 0.61: v64.8,91.78 51.78,91.78 51.78,95.27
  Bottom 0.406: U3.15 66.38,27.45 66.38,91.46 R3.2 v64.8,91.78
GND  (via drill 0.6)
  Top 0.406: U2.GND U2.7
  Bottom 0.406: U4.6 76.55,33.68 77.5,33.68 U4.2 | 60.22,12.09 U3.21 | 23.2,84.79 18.44,84.71 D7.3
  Bottom 0.61: v63.53,12.21 69.75,12.21 JP2.4 | 40.16,7.01 U3.2
  Bottom 0.813: U3.21 v63.53,12.21
  Bottom 1.016: v43.84,7.01 40.16,7.01 | U3.2 39.4,7.01 v37.49,7.01 JP3.3
  other vias: 70.83,18.44 89.88,96.86 90.2,12.41 5.11,12.09 26.38,31.77 26.38,33.68 4.15,23.84 22.25,26.69 72.73,37.81 7.33,28.92 27.65,96.54 64.48,29.23 60.35,37.17 64.48,26.38 72.42,95.27 88.29,85.11 76.23,95.27 72.42,91.78 76.23,91.78 26.38,35.58
  pour Top: -1.24,101.62 100.99,101.62 101.63,-2.72 -2.51,-2.52
  pour Bottom: -1.88,102.26 101.63,102.26 101.63,99.08 102.26,-3.79 -3.15,-3.79 -3.15,-0.61 -1.88,92.1
IRLED_DRIVE  (via drill 0.6)
  Top 0.61: v11.14,86.07 v11.14,89.88
  Bottom 0.406: v11.14,86.07 6.69,84.16 6.69,43.52 9.55,40.03 34,40.03 38.13,35.9 38.13,32.53 U3.12 | v11.14,89.88 R18.2
LED1  (via drill 0.6)
  Top 0.813: v4.86,86.09 5.11,86.16 v5.11,91.46
  Bottom 0.61: v4.86,86.09 4.79,42.88 4.79,42.25 8.28,38.12 33.05,38.12 35.9,35.26 35.9,28.6 36.86,27.33 39.9,27.33 U3.10 | v5.11,91.46 5.03,91.86 D1.A
LED2  (via drill 0.6)
  Top 0.61: v70.19,90.51 93.69,90.51 v94.96,91.46
  Bottom 0.406: D2.A 95.73,93.83 | 61.03,25.02 60.92,24.91 U3.16
  Bottom 0.61: 60.92,24.91 68.94,24.91 70.26,26.87 70.19,83.52 v70.19,90.51 | v94.96,91.46 94.89,92.03 94.89,93.09 D2.A
LED3
  Bottom 0.61: D3.A 5.11,3.27 5.11,3.2 6.06,2.25 44.79,2.25 46.06,3.2 46.06,19.07 45.43,19.71 40.16,19.71 U3.7 39.9,19.71
LED4
  Bottom 0.406: 60.99,14.63 60.86,14.75 U3.20
  Bottom 0.61: D4.A 94.57,3.2 93.94,2.25 55.59,2.25 54.64,3.18 54.64,13.36 55.91,14.63 60.22,14.63 U3.20
LIGHT_LEVEL  (via drill 0.6)
  Top 0.406: v8.28,86.07 8.28,97.81 80.67,97.81 80.67,96.88 | 80.67,96.88 80.67,96.75 U5.EMITTER 80.67,96.88 | 80.99,96.86 80.67,96.88
  Top 0.61: v84.8,96.86 80.99,96.86
  Bottom 0.406: v8.28,86.07 5.74,85.11 5.74,42.88 8.92,39.08 33.68,39.08 37.17,35.58 37.17,31.14 37.81,30.19 39.84,30.19 U3.11 | R15.1 v84.8,96.86
N$1
  Top 0.406: U1.4 U1.3
N$2  (via drill 0.6)
  Top 0.61: U1.5 47.65,93.5 v47.65,93.37
  Bottom 0.61: R4.2 47.64,92.1 47.65,92.1
  Bottom 1.016: C2.1 47.65,92.1 | 47.65,92.1 50.82,92.1 C1.A | 47.65,92.1 47.65,93.05 v47.65,93.37
N$3
  Bottom 0.61: D2.C 94.74,96.54 92.42,96.54 92.42,93.63 R5.1
N$4
  Bottom 0.61: D1.C 7.36,96.83 8.6,95.91 8.6,95 R6.1
N$5
  Bottom 0.406: JP2.2 60.35,7.01 U3.23
N$6  (via drill 0.6)
  Top 0.61: v11.14,96.32 v15.8,96.32
  Bottom 0.305: Q1.1 27.33,93.68 30.55,93.64 31.46,92.69 R19.2
  Bottom 0.406: R18.1 v11.14,96.32 | Q1.1 27.33,94.95 23.52,94.95 23.52,94.96 16.85,94.96 v15.8,96.32
N$7
  Bottom 1.016: JP2.3 60.48,9.55 U3.22
N$8
  Bottom 0.406: 89.56,38.44 R10.2 89.56,37.85 R7.2
N$9  (via drill 0.6)
  Top 0.406: v91.47,44.16 91.7,60.98 U$1.P$1
  Bottom 0.406: R10.1 v91.47,44.16
N$11
  Bottom 0.406: 9.52,24.15 U6.5
  Bottom 0.61: R17.2 9.27,23.83 U6.5
N$12  (via drill 0.6)
  Top 0.61: v25.43,92.1 25.43,93.37 21.16,93.37 LED1.A
  Bottom 0.61: R20.1 v25.43,92.1
N$13
  Bottom 0.406: 3.84,25.42 14.01,25.42 D8.2 | 3.84,87.33 16.22,87.33 16.92,86.76 D7.4
  Bottom 0.61: 3.84,25.42 3.84,87.33
N$14
  Bottom 0.406: U3.4 34.89,12.21 JP3.1
N$15
  Bottom 0.406: U3.3 31.52,9.67 JP3.2
N$16  (via drill 0.6)
  Top 0.254: U7.2 34.03,95.4 33.21,95.4 31.14,94.96 14.31,94.96 13.36,94 v13.36,86.07
  Top 0.61: v39.4,34.95 v31.78,34.95
  Bottom 0.406: v13.36,86.07 13.36,84.79 10.82,84.79 7.65,83.21 7.65,43.84 9.87,40.98 34.32,40.98 39.4,35.9 v39.4,34.95 | v31.78,34.95 31.77,33.99
  Bottom 0.61: 31.77,33.99 R23.2
N$17
  Bottom 0.406: TP1.TP 89.89,19.38 D5.2
N$18  (via drill 0.6)
  Top 0.61: v72.42,86.7 v57.81,86.7 | v22.89,86.7 18.76,86.7 v18.76,89.88
  Bottom 0.406: v22.89,86.7 55.26,86.68 v57.8,86.7 v57.81,86.7 | v72.42,86.7 72.42,85.43 82.1,85.43 D6.4 | 19.7,90.19 D7.2 20.03,89.88 v18.76,89.88
N$19
  Bottom 0.406: U4.3 78.45,34.63 80.67,34.63 C4.2 | C4.2 81.12,34.67 R7.1 | C5.2 C4.2
N$20
  Bottom 0.406: U4.4 78.45,32.73 80.98,32.73 C4.1 C5.1
N$21
  Bottom 0.406: D5.4 93.09,28.31 97.82,28.28 97.82,89.56 85.69,89.56 D6.2
N$22
  Bottom 0.406: R11.2 22.57,22.57 20.32,22.57 D8.4
N$23  (via drill 0.6)
  Top 0.61: v21.62,91.15 18.76,91.15 LED2.A
  Bottom 0.61: R21.1 22.57,91.15 v21.62,91.15
N$24  (via drill 0.6)
  Top 0.406: LED1.C 21.52,96.64 21.93,96.23 v24.47,96.23 | 19.23,96.23 LED2.C
  Top 1.016: v24.47,96.23 19.23,96.23
  Bottom 0.406: Q1.3 26.06,96.23
  Bottom 1.016: 26.06,96.23 v24.47,96.23
N$25  (via drill 0.6)
  Top 0.305: U7.6 36.97,94.76 v38.29,94.76
  Bottom 0.305: v38.29,94.76 38.92,94.76 R22.1
N$30
  Bottom 0.61: R8.1 7.65,6.37 5.57,6.37 D3.C
N$31
  Bottom 0.61: 94.64,7.01 R9.1
  Bottom 1.016: D4.C 94.64,7.01
NEOPIXELS_DIN
  Bottom 0.406: 39.84,14.94 32.41,14.94 32.41,17.48 31.78,18.12 24.47,18.12 R12.2 R11.1
  Bottom 0.61: 39.84,14.94 U3.5
SCL  (via drill 0.6)
  Top 0.305: U7.7 37.53,95.32 37.81,95.59 39.71,95.59 v39.71,92.73 | U1.7 48.19,94.85 42.89,94.8 v42.89,92.73
  Top 0.406: U2.SCK 62.89,94 v62.89,92.73
  Top 0.61: v39.71,92.73 39.71,88.6 v62.89,88.6
  Bottom 0.406: U3.14 62.89,29.99 v62.89,88.6 v62.89,92.73 | R1.1 v39.71,92.73 v42.89,92.73
SDA  (via drill 0.6)
  Top 0.305: U7.8 36.43,95.82 36.44,96.67 41.3,96.67 v41.3,90.19
  Top 0.406: v68.29,94.76 68.29,94.32 67.88,94 66.44,94 U2.DATA
  Top 0.61: U1.1 57.81,96.41 v57.81,93.68 | v41.3,90.19 v61.62,90.19
  Bottom 0.305: R2.1 37.49,89.56 37.49,90.19 v41.3,90.19
  Bottom 0.406: U3.13 61.62,32.53 v61.62,90.19 61.62,93.68 | 68.29,94.45 v68.29,94.76 68.29,94.64 67.65,94 61.62,94 61.62,93.68 | 61.62,93.68 v57.81,93.68
TOUCH
  Bottom 0.406: U3.18 60.67,19.71 72.5,19.71 73.46,20.66 73.46,35.05 U4.1
TOUCH_VDD
  Bottom 0.406: 60.35,17.17 U3.19
  Bottom 0.61: U4.5 77.5,27.96 | 77.5,27.96 77.5,17.17 TP7.TP 60.35,17.17 | C6.2 77.52,28.3 77.5,27.96
V_BATT
  Bottom 0.406: 24.79,29.07 J1.2 24.43,29.55 24.16,29.55
  Bottom 0.61: 11.77,27.33 11.77,27.04 U6.3 | J1.2 24.47,28.66 24.47,26.06 25.11,25.42 R13.1 30.82,28.28 R23.1 | TP2.TP 16.85,34.63 D9.A
  Bottom 0.813: D9.A 14,33.29 | 14,33.29 13.29,33.29 12.2,31.51 11.77,30.82 11.77,27.33 | C11.1 13.99,33.29 14,33.29
  Bottom 1.016: D9.A 19.64,30.57 20.35,29.87 23.84,29.87 24.16,29.55

### Text on the board
bNames: 3v3 | Jedi Light Switch | Github.com/Tinamous/JediLightSwitch | S.Harrison 12-Jan-2016 | V1.2 | Dout | DAC | Rx | GND | Tx | VBatt | Reset | GND | Vin | GND | Vin | 3v3 | 3v3